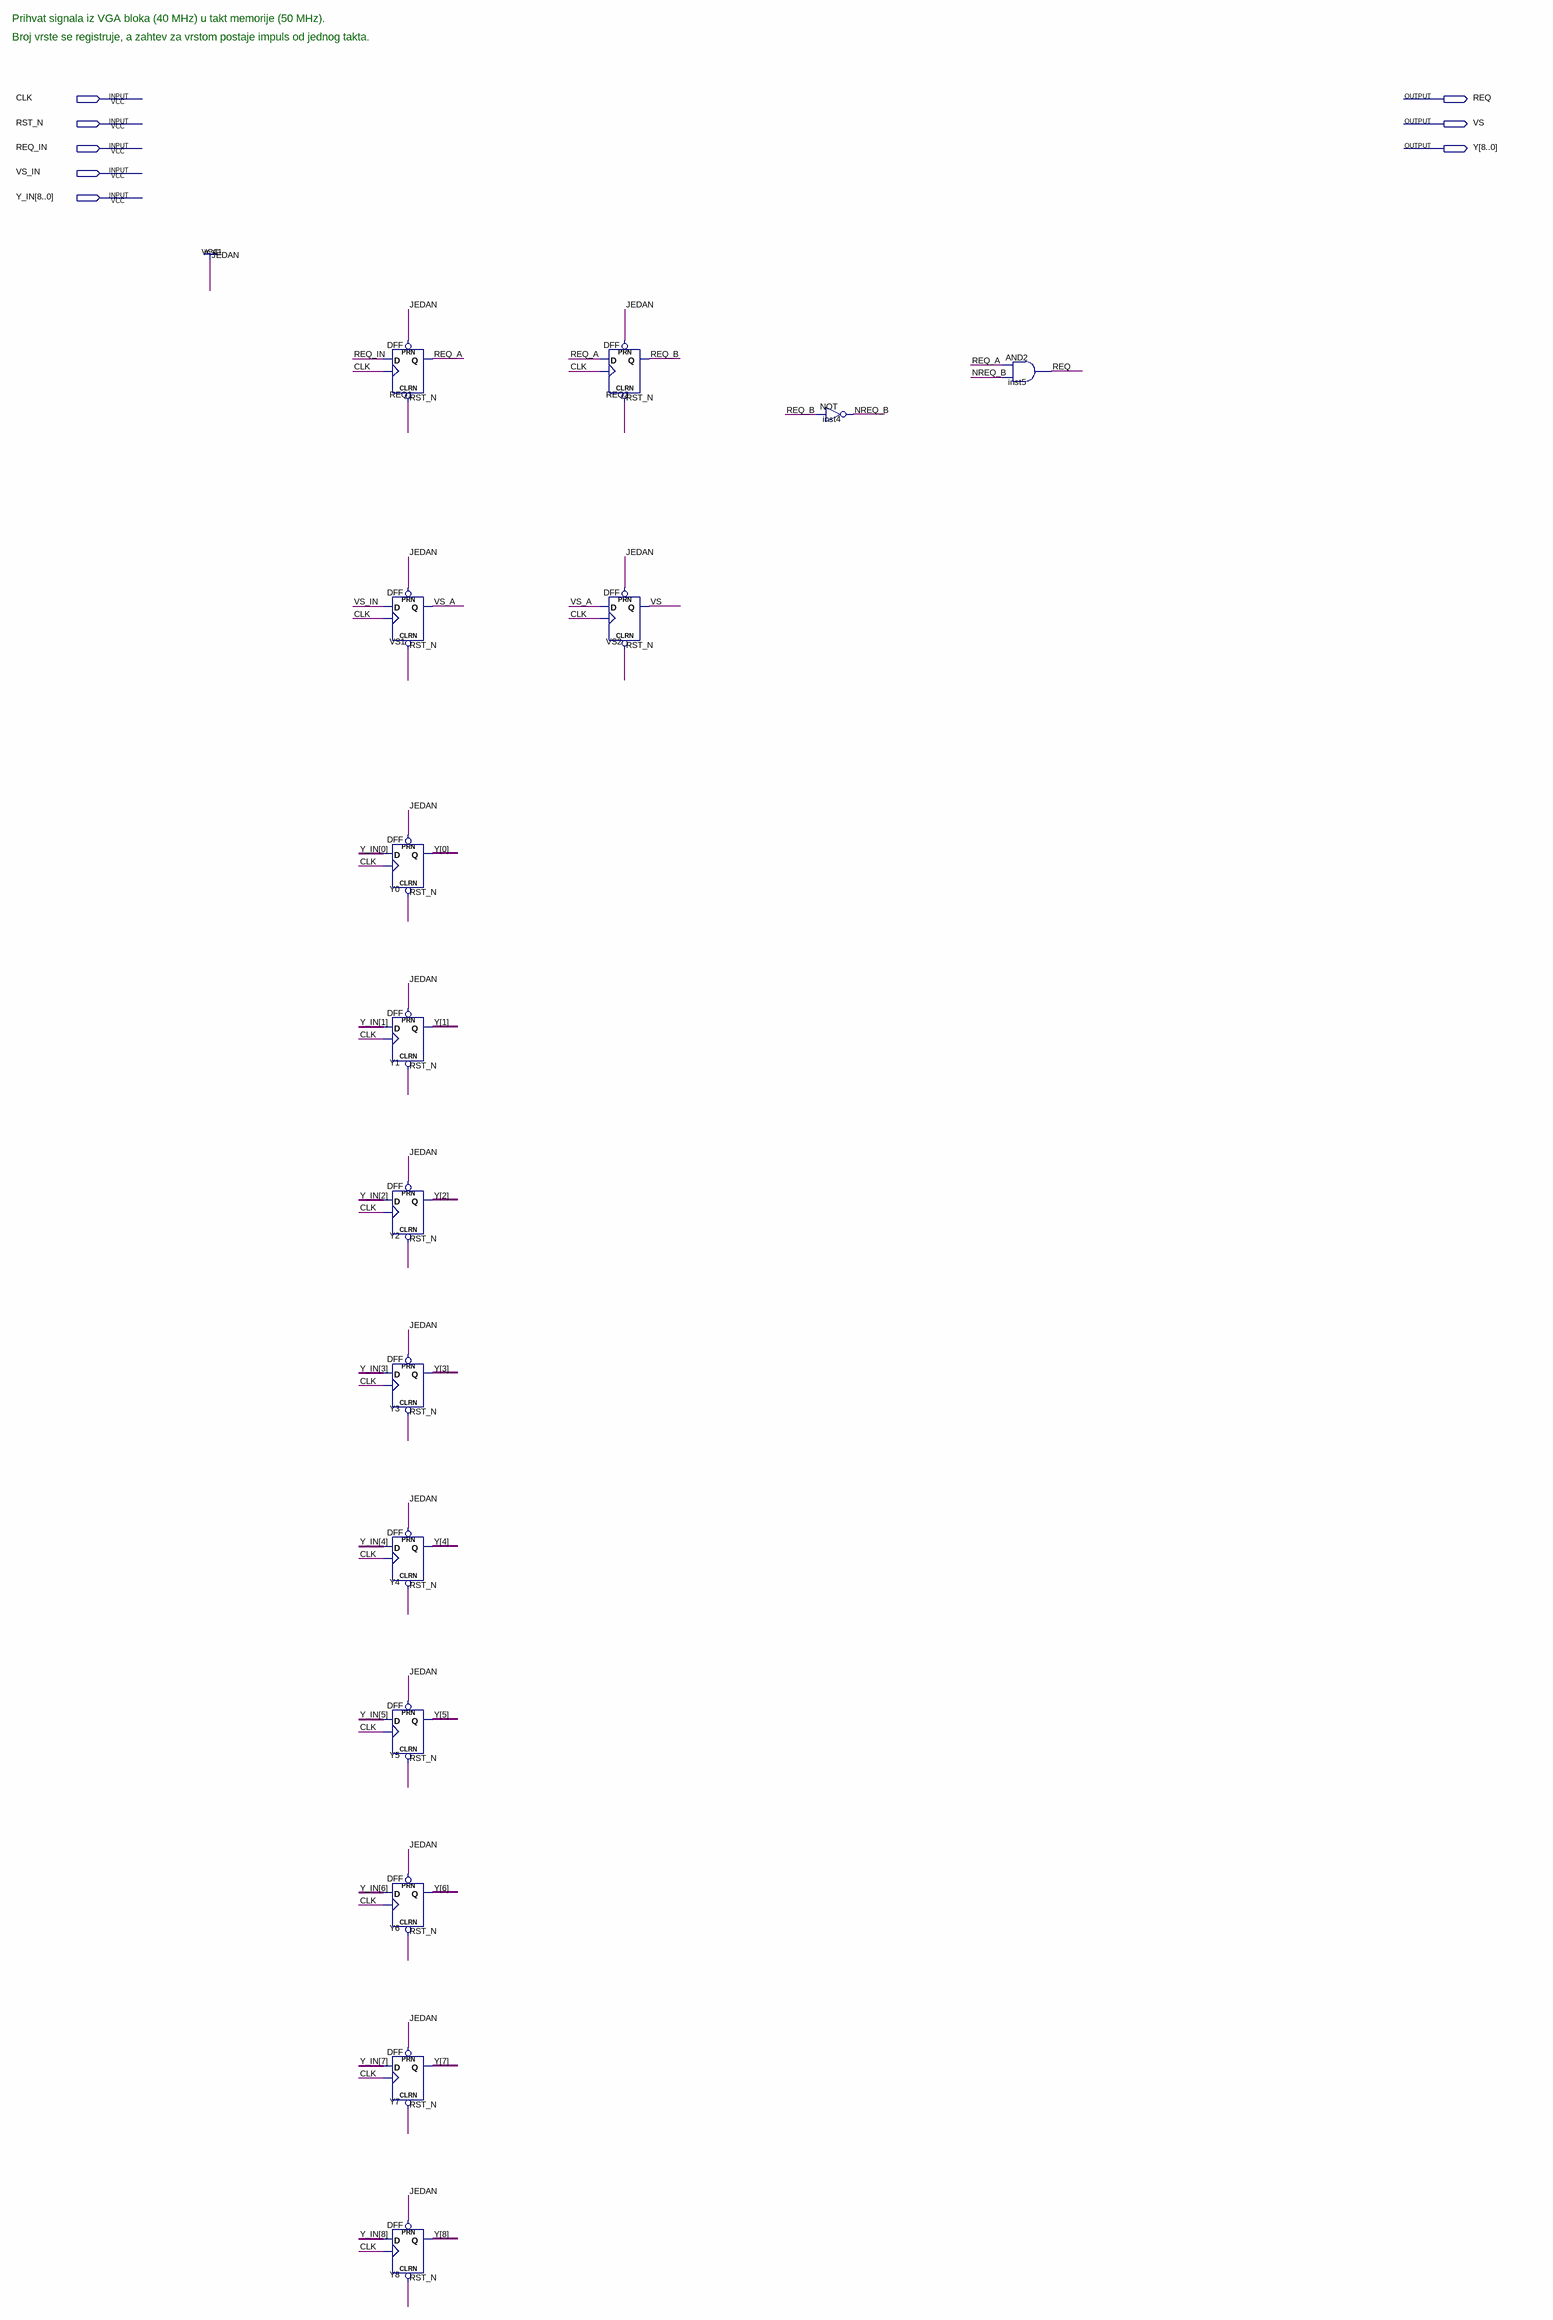
[diagram p0: schematic sheet]
// Quartus schematic line_sync.bdf as structural Verilog: 15 symbols, 8 pins
module line_sync (
  input  CLK,
  input  RST_N,
  input  REQ_IN,
  input  VS_IN,
  input  [8:0] Y_IN,
  output REQ,
  output VS,
  output [8:0] Y
);

  wire NREQ_B, REQ_A, REQ_B, VS_A;

  DFF REQ1 (.CLRN(RST_N), .CLK(CLK), .D(REQ_IN), .PRN(1'b1), .Q(REQ_A));
  DFF VS1 (.CLRN(RST_N), .CLK(CLK), .D(VS_IN), .PRN(1'b1), .Q(VS_A));
  DFF Y0 (.CLRN(RST_N), .CLK(CLK), .D(Y_IN[0]), .PRN(1'b1), .Q(Y[0]));
  DFF Y1 (.CLRN(RST_N), .CLK(CLK), .D(Y_IN[1]), .PRN(1'b1), .Q(Y[1]));
  DFF Y2 (.CLRN(RST_N), .CLK(CLK), .D(Y_IN[2]), .PRN(1'b1), .Q(Y[2]));
  DFF Y3 (.CLRN(RST_N), .CLK(CLK), .D(Y_IN[3]), .PRN(1'b1), .Q(Y[3]));
  DFF Y4 (.CLRN(RST_N), .CLK(CLK), .D(Y_IN[4]), .PRN(1'b1), .Q(Y[4]));
  DFF Y5 (.CLRN(RST_N), .CLK(CLK), .D(Y_IN[5]), .PRN(1'b1), .Q(Y[5]));
  DFF Y6 (.CLRN(RST_N), .CLK(CLK), .D(Y_IN[6]), .PRN(1'b1), .Q(Y[6]));
  DFF Y7 (.CLRN(RST_N), .CLK(CLK), .D(Y_IN[7]), .PRN(1'b1), .Q(Y[7]));
  DFF Y8 (.CLRN(RST_N), .CLK(CLK), .D(Y_IN[8]), .PRN(1'b1), .Q(Y[8]));
  DFF REQ2 (.CLRN(RST_N), .CLK(CLK), .D(REQ_A), .PRN(1'b1), .Q(REQ_B));
  DFF VS2 (.CLRN(RST_N), .CLK(CLK), .D(VS_A), .PRN(1'b1), .Q(VS));
  not inst4 (NREQ_B, REQ_B);
  and inst5 (REQ, REQ_A, NREQ_B);

  // Notes on the sheet:
  //   Prihvat signala iz VGA bloka (40 MHz) u takt memorije (50 MHz).
  //   Broj vrste se registruje, a zahtev za vrstom postaje impuls od jednog takta.
endmodule
